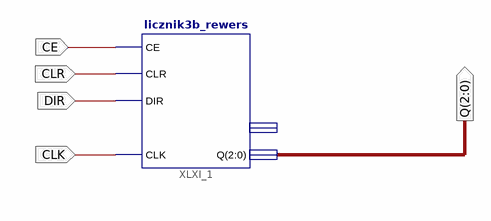
[diagram p0: schematic sheet 1]
// Xilinx ISE schematic licznik3b_schemat.sch (xc9500xl) as structural Verilog: 1 symbols, 5 ports
module licznik3b_schemat (
  input  CLK,
  input  CE,
  input  CLR,
  input  DIR,
  output [2:0] Q
);

  licznik3b_rewers XLXI_1 (.CE(CE), .CLR(CLR), .DIR(DIR), .CLK(CLK), .Q(Q));  // open: D
endmodule
